# Altium project gimbal.PrjPcb
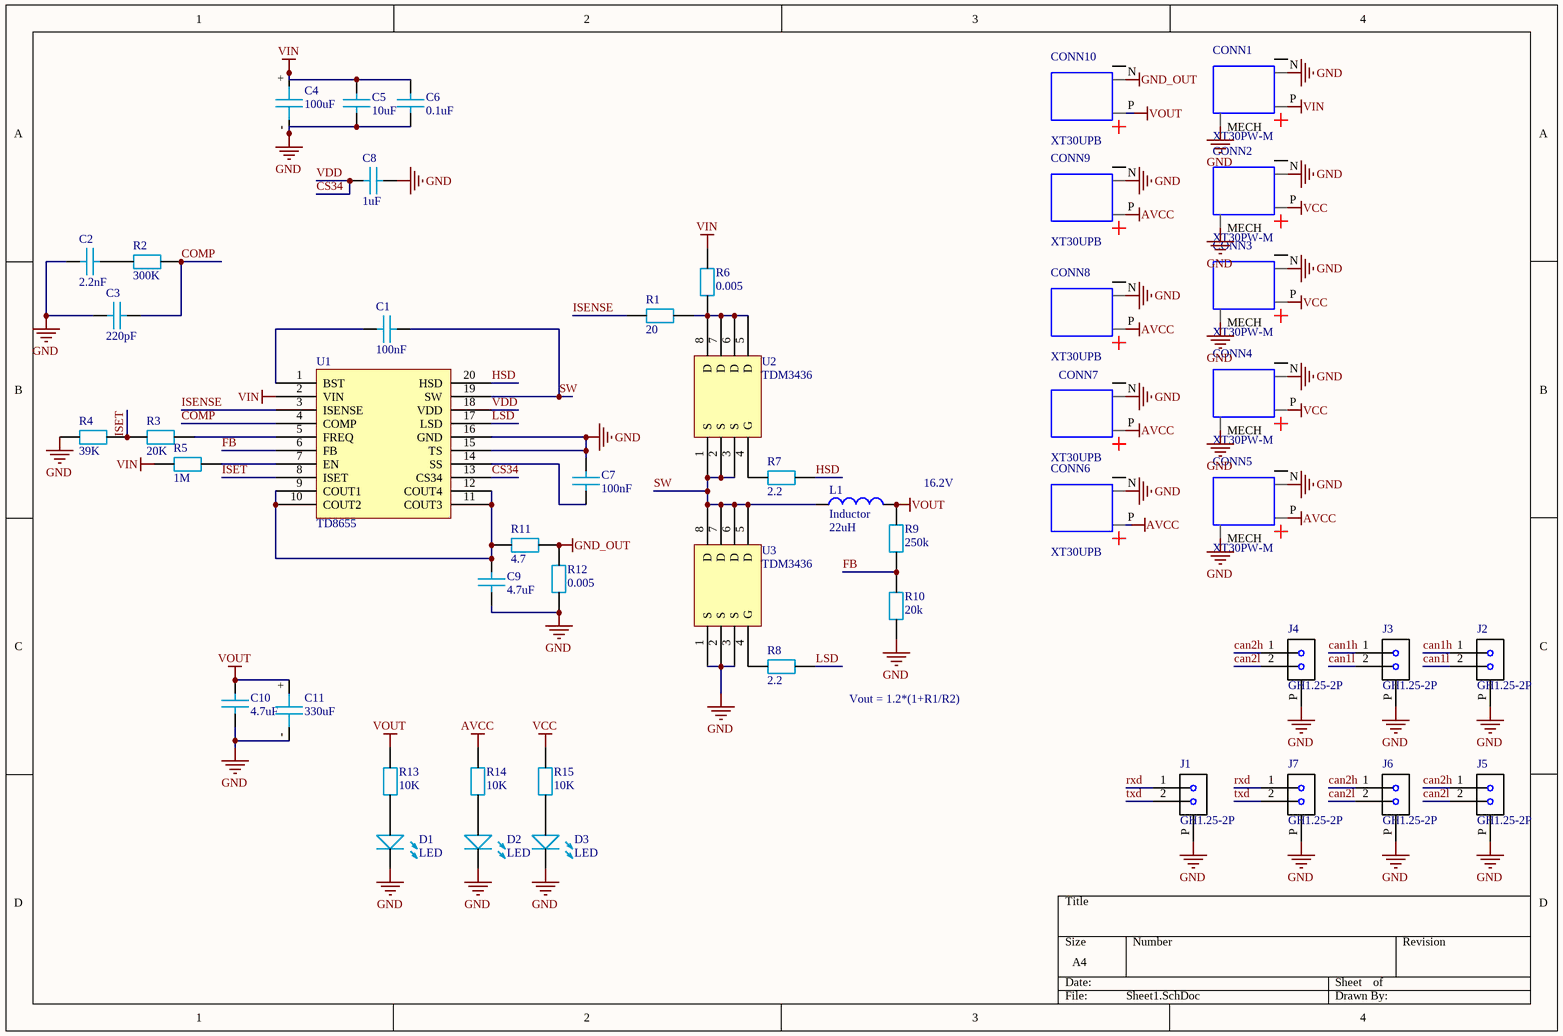
[diagram p0: Sheet1.SchDoc]
1 sheet, 50 parts. Net scope: global (net labels, ports and power ports of the same name join across sheets).
Board file: PCB2.PcbDoc

## Sheet Sheet1.SchDoc
size A4

### Parts
C1  100nF  [0603_C]
C2  2.2nF  [0603_C]
C3  220pF  [0603_C]
C4  100uF  [rad8*11]
C5  10uF  [0805_C]
C6  0.1uF  [0805_C]
C7  100nF  [0603_C]
C8  1uF  [0603_C]
C9  4.7uF  [0603_C]
C10  4.7uF  [0805_C]
C11  330uF  [dip-ec10*17]
CONN1  XT30PW-M  [xt30pw-m]
CONN2  XT30PW-M  [xt30pw-m]
CONN3  XT30PW-M  [xt30pw-m]
CONN4  XT30PW-M  [xt30pw-m]
CONN5  XT30PW-M  [xt30pw-m]
CONN6  XT30UPB  [XT30UPB]
CONN7  XT30UPB  [XT30UPB]
CONN8  XT30UPB  [XT30UPB]
CONN9  XT30UPB  [XT30UPB]
CONN10  XT30UPB  [XT30UPB]
D1  LED  [LED_0805]
D2  LED  [LED_0805]
D3  LED  [LED_0805]
J1  GH1.25-2P  [gh1.25-2p-立]
J2  GH1.25-2P  [gh1.25-2p-立]
J3  GH1.25-2P  [gh1.25-2p-立]
J4  GH1.25-2P  [gh1.25-2p-立]
J5  GH1.25-2P  [gh1.25-2p-立]
J6  GH1.25-2P  [gh1.25-2p-立]
J7  GH1.25-2P  [gh1.25-2p-立]
L1  Inductor  value 22uH  [SRP1265A-220M]
R1  20  [0603-R]
R2  300K  [0603-R]
R3  20K  [0603-R]
R4  39K  [0603-R]
R5  1M  [0603-R]
R6  0.005  [2512]
R7  2.2  [0603-R]
R8  2.2  [0603-R]
R9  250k  [0603-R]
R10  20k  [0603-R]
R11  4.7  [0603-R]
R12  0.005  [2512]
R13  10K  [0603-R]
R14  10K  [0603-R]
R15  10K  [0603-R]
U1  TD8655  [LC-QFN-20_4x4x05P]
U2  TDM3436  [LC-DFN-8_5x6mm]
U3  TDM3436  [LC-DFN-8_5x6mm]

### Nets
AVCC: CONN5.P CONN6.P CONN7.P CONN8.P CONN9.P R14.2
GND: C2.1 C3.1 C4.- C5.1 C6.1 C7.2 C8.1 C9.1 C10.1 C11.- CONN1.3(MECH) CONN1.N CONN2.3(MECH) CONN2.N CONN3.3(MECH) CONN3.N CONN4.3(MECH) CONN4.N CONN5.3(MECH) CONN5.N CONN6.N CONN7.N CONN8.N CONN9.N D1.2 D2.2 D3.2 J1.P J2.P J3.P J4.P J5.P J6.P J7.P R4.1 R10.1 R12.1 U1.15(TS) U1.16(GND) U3.1(S) U3.2(S) U3.3(S)
GND_OUT: CONN10.N R11.2 R12.2
VCC: CONN2.P CONN3.P CONN4.P R15.2
VIN: C4.+ C5.2 C6.2 CONN1.P R5.1 R6.2 U1.2(VIN)
VOUT: C10.2 C11.+ CONN10.P L1.2 R9.2 R13.2
can1h: J2.1 J3.1
can1l: J2.2 J3.2
can2h: J4.1 J5.1 J6.1
can2l: J4.2 J5.2 J6.2
COMP: C3.2 R2.2 U1.4(COMP)
CS34: C8.2 U1.13(CS34) U1.18(VDD)  [also labelled VDD]
FB: R9.1 R10.2 U1.6(FB)
HSD: R7.1 U1.20(HSD)
ISENSE: R1.1 U1.3(ISENSE)
ISET: R3.1 R4.2 U1.8(ISET)
LSD: R8.1 U1.17(LSD)
rxd: J1.1 J7.1
SW: C1.1 L1.1 U1.19(SW) U2.1(S) U2.2(S) U2.3(S) U3.5(D) U3.6(D) U3.7(D) U3.8(D)
txd: J1.2 J7.2
NetC1_2: C1.2 U1.1(BST)
NetC2_2: C2.2 R2.1
NetC7_1: C7.1 U1.14(SS)
NetC9_2: C9.2 R11.1 U1.9(COUT1) U1.10(COUT2) U1.11(COUT3) U1.12(COUT4)
NetD1_1: D1.1 R13.1
NetD2_1: D2.1 R14.1
NetD3_1: D3.1 R15.1
NetR1_2: R1.2 R6.1 U2.5(D) U2.6(D) U2.7(D) U2.8(D)
NetR3_2: R3.2 U1.5(FREQ)
NetR5_2: R5.2 U1.7(EN)
NetR7_2: R7.2 U2.4(G)
NetR8_2: R8.2 U3.4(G)

### Notes on the sheet
- 16.2V
- Vout = 1.2*(1+R1/R2)

### Library data of the parts
C1-C3 C5-C10 = C
C4 C11 = CD
CONN1-CONN5 = XT30PW-M: 卧式焊板XT30（公）
CONN6-CONN10 = XT30UPB: 立式焊板XT30（通用）
J1-J7 = GH1.25-2P: MP: 53261-0271; MF: Molex; SnapEDA_Link: https://www.snapeda.com/parts/53261-0271/Molex/view-part/?ref=snap; Availability: Good; Price: 0.42 USD; Package: None; Value: *
L1 = Inductor: Code_IEC: 1005; Published: 8-Jun-2000; LatestRevisionDate: 29-May-2009; LatestRevisionNote: IPC-7351 Footprint Added.; PackageReference: 0402-A; Publisher: Altium Limited; PackageDescription: Chip Inductor; Code_JEITA: 0402
R1-R15 = R